# Altium schematic sheet Opioid - uC - rev.A0.SchDoc
size A4
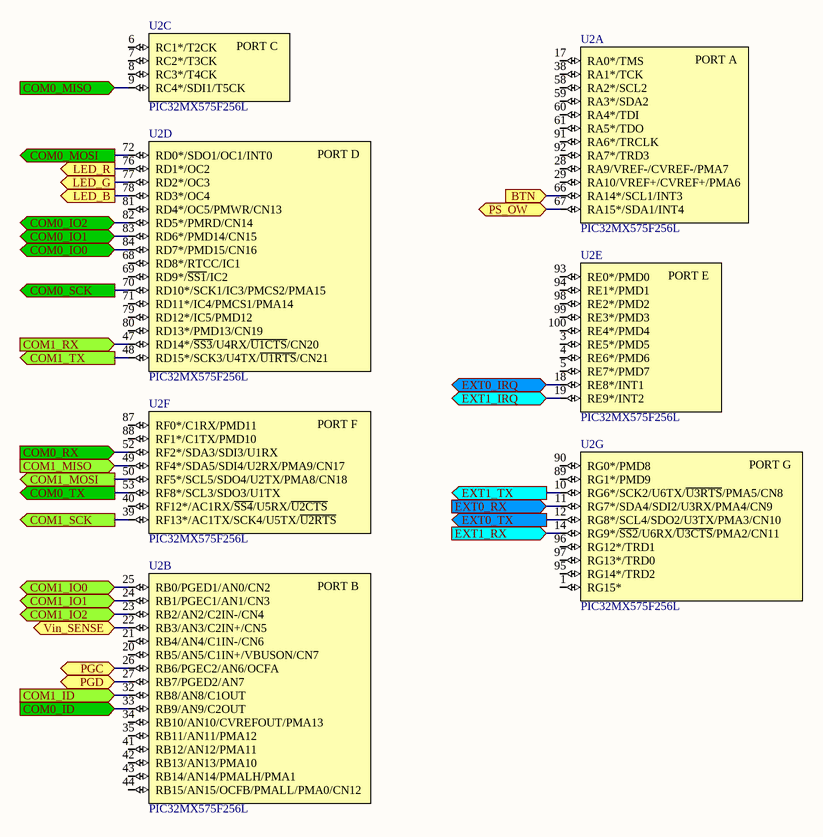
[diagram p0: Opioid - uC - rev.A0.SchDoc]

## Parts
U2  PIC32MX575F256L  [TQFP-PT100_N]  (parts A,B,C,D,E,F,G of 9)

## Ports
BTN (in), COM0_ID (in), COM0_IO0 (bidir), COM0_IO1 (bidir), COM0_IO2 (bidir), COM0_MISO (in), COM0_MOSI (out), COM0_RX (in), COM0_SCK (out), COM0_TX (out), COM1_ID (in), COM1_IO0 (bidir), COM1_IO1 (bidir), COM1_IO2 (bidir), COM1_MISO (in), COM1_MOSI (out), COM1_RX (in), COM1_SCK (out), COM1_TX (out), EXT0_IRQ (bidir), EXT0_RX (in), EXT0_TX (out), EXT1_IRQ (bidir), EXT1_RX (in), EXT1_TX (out), LED_B (out), LED_G (out), LED_R (out), PGC (bidir), PGD (bidir), PS_OW (bidir), Vin_SENSE (bidir)

## Nets
BTN: U2.66(RA14*/SCL1/INT3) ; port BTN
COM0_ID: U2.33(RB9/AN9/C2OUT) ; port COM0_ID
COM0_IO0: U2.84(RD7*/PMD15/CN16) ; port COM0_IO0
COM0_IO1: U2.83(RD6*/PMD14/CN15) ; port COM0_IO1
COM0_IO2: U2.82(RD5*/PMRD/CN14) ; port COM0_IO2
COM0_MISO: U2.9(RC4*/SDI1/T5CK) ; port COM0_MISO
COM0_MOSI: U2.72(RD0*/SDO1/OC1/INT0) ; port COM0_MOSI
COM0_RX: U2.52(RF2*/SDA3/SDI3/U1RX) ; port COM0_RX
COM0_SCK: U2.70(RD10*/SCK1/IC3/PMCS2/PMA15) ; port COM0_SCK
COM0_TX: U2.53(RF8*/SCL3/SDO3/U1TX) ; port COM0_TX
COM1_ID: U2.32(RB8/AN8/C1OUT) ; port COM1_ID
COM1_IO0: U2.25(RB0/PGED1/AN0/CN2) ; port COM1_IO0
COM1_IO1: U2.24(RB1/PGEC1/AN1/CN3) ; port COM1_IO1
COM1_IO2: U2.23(RB2/AN2/C2IN-/CN4) ; port COM1_IO2
COM1_MISO: U2.49(RF4*/SDA5/SDI4/U2RX/PMA9/CN17) ; port COM1_MISO
COM1_MOSI: U2.50(RF5*/SCL5/SDO4/U2TX/PMA8/CN18) ; port COM1_MOSI
COM1_RX: U2.47(RD14*/~{SS3}/U4RX/~{U1CTS}/CN20) ; port COM1_RX
COM1_SCK: U2.39(RF13*/AC1TX/SCK4/U5TX/~{U2RTS}) ; port COM1_SCK
COM1_TX: U2.48(RD15*/SCK3/U4TX/~{U1RTS}/CN21) ; port COM1_TX
EXT0_IRQ: U2.18(RE8*/INT1) ; port EXT0_IRQ
EXT0_RX: U2.11(RG7*/SDA4/SDI2/U3RX/PMA4/CN9) ; port EXT0_RX
EXT0_TX: U2.12(RG8*/SCL4/SDO2/U3TX/PMA3/CN10) ; port EXT0_TX
EXT1_IRQ: U2.19(RE9*/INT2) ; port EXT1_IRQ
EXT1_RX: U2.14(RG9*/~{SS2}/U6RX/~{U3CTS}/PMA2/CN11) ; port EXT1_RX
EXT1_TX: U2.10(RG6*/SCK2/U6TX/~{U3RTS}/PMA5/CN8) ; port EXT1_TX
LED_B: U2.78(RD3*/OC4) ; port LED_B
LED_G: U2.77(RD2*/OC3) ; port LED_G
LED_R: U2.76(RD1*/OC2) ; port LED_R
PGC: U2.26(RB6/PGEC2/AN6/OCFA) ; port PGC
PGD: U2.27(RB7/PGED2/AN7) ; port PGD
PS_OW: U2.67(RA15*/SDA1/INT4) ; port PS_OW
Vin_SENSE: U2.22(RB3/AN3/C2IN+/CN5) ; port Vin_SENSE

Not connected (* = marked no-connect by the designer): U2 1(RG15*) 3(RE5*/PMD5) 4(RE6*/PMD6) 5(RE7*/PMD7) 6(RC1*/T2CK) 7(RC2*/T3CK) 8(RC3*/T4CK) 17(RA0*/TMS) 20(RB5/AN5/C1IN+/VBUSON/CN7) 21(RB4/AN4/C1IN-/CN6) 28(RA9/VREF-/CVREF-/PMA7) 29(RA10/VREF+/CVREF+/PMA6) 34(RB10/AN10/CVREFOUT/PMA13) 35(RB11/AN11/PMA12) 38(RA1*/TCK) 40(RF12*/AC1RX/~{SS4}/U5RX/~{U2CTS}) 41(RB12/AN12/PMA11) 42(RB13/AN13/PMA10) 43(RB14/AN14/PMALH/PMA1) 44(RB15/AN15/OCFB/PMALL/PMA0/CN12) 58(RA2*/SCL2) 59(RA3*/SDA2) 60(RA4*/TDI) 61(RA5*/TDO) 68(RD8*/RTCC/IC1) 69(RD9*/~{SS1}/IC2) 71(RD11*/IC4/PMCS1/PMA14) 79(RD12*/IC5/PMD12) 80(RD13*/PMD13/CN19) 81(RD4*/OC5/PMWR/CN13) 87(RF0*/C1RX/PMD11) 88(RF1*/C1TX/PMD10) 89(RG1*/PMD9) 90(RG0*/PMD8) 91(RA6*/TRCLK) 92(RA7*/TRD3) 93(RE0*/PMD0) 94(RE1*/PMD1) 95(RG14*/TRD2) 96(RG12*/TRD1) 97(RG13*/TRD0) 98(RE2*/PMD2) 99(RE3*/PMD3) 100(RE4*/PMD4)

## Notes on the sheet
- (in symbol PIC32MX575F256L, part A) PORT A
- (in symbol PIC32MX575F256L, part B) PORT B
- (in symbol PIC32MX575F256L, part C) PORT C
- (in symbol PIC32MX575F256L, part D) PORT D
- (in symbol PIC32MX575F256L, part E) PORT E
- (in symbol PIC32MX575F256L, part F) PORT F
- (in symbol PIC32MX575F256L, part G) PORT G